# Altium schematic sheet Buck_regulator.SchDoc: FPGA Motherboard for Digital Multiplexed Readout, McGill U.
size A; DocumentNumber: DfMUX22; Revision: Rev0, Prototype; SheetNumber: 22; SheetTotal: 27; PageSetup: Record=PageOptions|CenterHorizontal=True|CenterVertical=True|PrintScale=1.05|XCorrection=1.00|YCorrection=1.00|PrintKind=0|BorderSize=5000000|LeftOffset=0|BottomOffset=0|Orientation=2|PaperLength=1000|PaperWidth=1000|Scale=100|PaperSource=7|PrintQuality=-4|MediaType=1|DitherType=10|PaperKind=Letter|PrintScaleMode=1
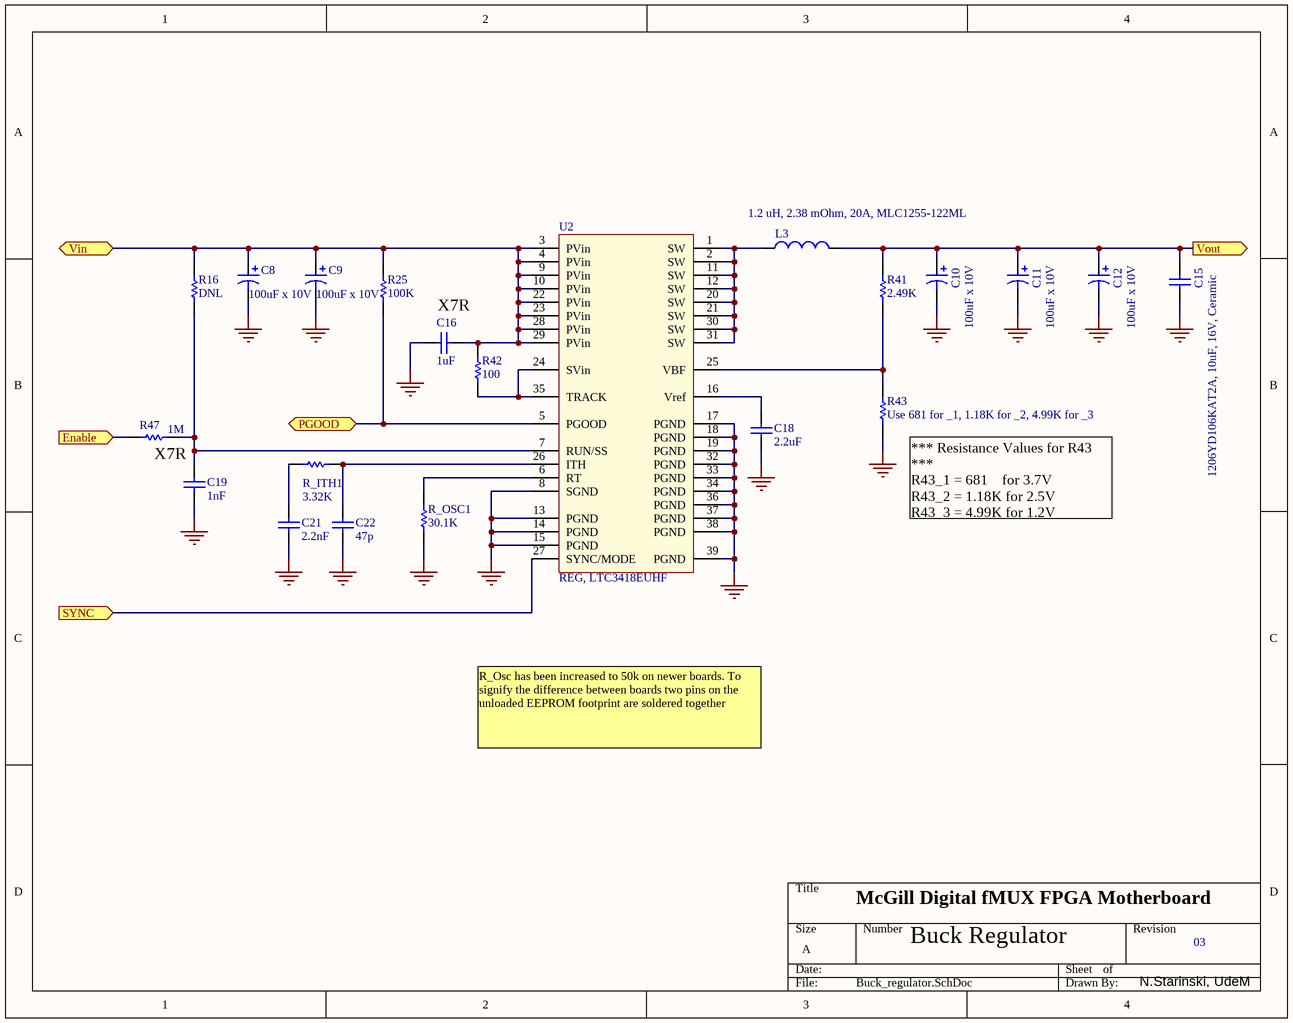
[diagram p0: Buck_regulator.SchDoc]

## Parts
C8  100uF x 10V  [TC6032-2412]
C9  100uF x 10V  [TC6032-2412]
C10  100uF x 10V  [TC6032-2412]
C11  100uF x 10V  [TC6032-2412]
C12  100uF x 10V  [TC6032-2412]
C15  1206YD106KAT2A, 10uF, 16V, Ceramic  [CC3225-1210]
C16  1uF  [CC1608-0603]
C18  2.2uF  [CC3225-1210]
C19  1nF  [CC1608-0603]
C21  2.2nF  [CC1608-0603]
C22  47p  [CC1608-0603]
L3  1.2 uH, 2.38 mOhm, 20A, MLC1255-122ML  [MLC_inductor]
R16  DNL  [CR1608-0603]
R25  100K  [CR1608-0603]
R41  2.49K  [CR1608-0603]
R42  100  [CR1608-0603]
R43  Use 681 for _1, 1.18K for _2, 4.99K for _3  [CR1608-0603]
R47  1M  [CR1608-0603]
R_ITH1  3.32K  [CR1608-0603]
R_OSC1  30.1K  [CR1608-0603]
U2  REG, LTC3418EUHF  [UH38_N]

## Ports
Enable (in), PGOOD (bidir), SYNC (in), Vin, Vout (out)

## Nets
GND: C8.2 C9.2 C10.2 C11.2 C12.2 C15.2 C16.1 C18.1 C19.1 C21.1 C22.1 R43.1 R_OSC1.1 U2.8(SGND) U2.13(PGND) U2.14(PGND) U2.15(PGND) U2.17(PGND) U2.18(PGND) U2.19(PGND) U2.32(PGND) U2.33(PGND) U2.34(PGND) U2.36(PGND) U2.37(PGND) U2.38(PGND) U2.39(PGND)
Enable: R47.1 ; port Enable
PGOOD: R25.1 U2.5(PGOOD) ; port PGOOD
SYNC: U2.27(SYNC/MODE) ; port SYNC
Vin: C8.1 C9.1 C16.2 R16.2 R25.2 R42.2 U2.3(PVin) U2.4(PVin) U2.9(PVin) U2.10(PVin) U2.22(PVin) U2.23(PVin) U2.28(PVin) U2.29(PVin) ; port Vin
Vout: C10.1 C11.1 C12.1 C15.1 L3.2 R41.2 ; port Vout
NetC18_2: C18.2 U2.16(Vref)
NetC19_2: C19.2 R16.1 R47.2 U2.7(RUN/SS)
NetC21_2: C21.2 R_ITH1.1
NetC22_2: C22.2 R_ITH1.2 U2.26(ITH)
NetL3_1: L3.1 U2.1(SW) U2.2(SW) U2.11(SW) U2.12(SW) U2.20(SW) U2.21(SW) U2.30(SW) U2.31(SW)
NetR41_1: R41.1 R43.2 U2.25(VBF)
NetR42_1: R42.1 U2.24(SVin) U2.35(TRACK)
NetR_OSC1_2: R_OSC1.2 U2.6(RT)

## Notes on the sheet
- X7R
- (near R47) X7R
- (near R43) *** Resistance Values for R43 ***
  R43_1 = 681    for 3.7V
  R43_2 = 1.18K for 2.5V
  R43_3 = 4.99K for 1.2V
- R_Osc has been increased to 50k on newer boards. To signify the difference between boards two pins on the unloaded EEPROM footprint are soldered together
- McGill Digital fMUX FPGA Motherboard
- Buck Regulator
- 03
- N.Starinski, UdeM

## Library data of the parts
C8-C12 = Cap Pol3: CAP TANTC TPSC107K010R0075; Published: 8-Jun-2000; LatestRevisionDate: 17-Jul-2002; LatestRevisionNote: Re-released for DXP Platform.; PackageReference: C0805; Publisher: Altium Limited
C15 = Cap Semi: CAP POL 1206YD106KAT2A; Published: 8-Jun-2000; LatestRevisionDate: 17-Jul-2002; LatestRevisionNote: Re-released for DXP Platform.; PackageReference: C1206; Publisher: Altium Limited
C16 C19 C21 C22 = Cap Semi: Capacitor (Semiconductor SIM Model); Published: 8-Jun-2000; LatestRevisionDate: 17-Jul-2002; LatestRevisionNote: Re-released for DXP Platform.; PackageReference: C1206; Publisher: Altium Limited
C18 = Cap Semi: Capacitor (use 1206 footprint); Published: 8-Jun-2000; LatestRevisionDate: 17-Jul-2002; LatestRevisionNote: Re-released for DXP Platform.; PackageReference: C1206; Publisher: Altium Limited
L3 = Inductor: Code_IEC: 1005; Published: 8-Jun-2000; LatestRevisionDate: 17-Jul-2002; LatestRevisionNote: Re-released for DXP Platform.; PackageReference: 0402-A; Publisher: Altium Limited; Code_JEITA: 0402
R16 R25 R42 R43 = Res Semi: Semiconductor Resistor; Published: 8-Jun-2000; LatestRevisionDate: 17-Jul-2002; LatestRevisionNote: Re-released for DXP Platform.; Publisher: Altium Limited
R41 R47 R_ITH1 R_OSC1 = Res Semi: Resistor 0603; Published: 8-Jun-2000; LatestRevisionDate: 17-Jul-2002; LatestRevisionNote: Re-released for DXP Platform.; Publisher: Altium Limited
U2 = LTC3418: 8A, 4MHz, Monolithic Syncronous Step-Down Regulator